# Altium schematic sheet OTHER.SchDoc
size 420 x 297 mm; SheetNumber: 8; SheetTotal: 9
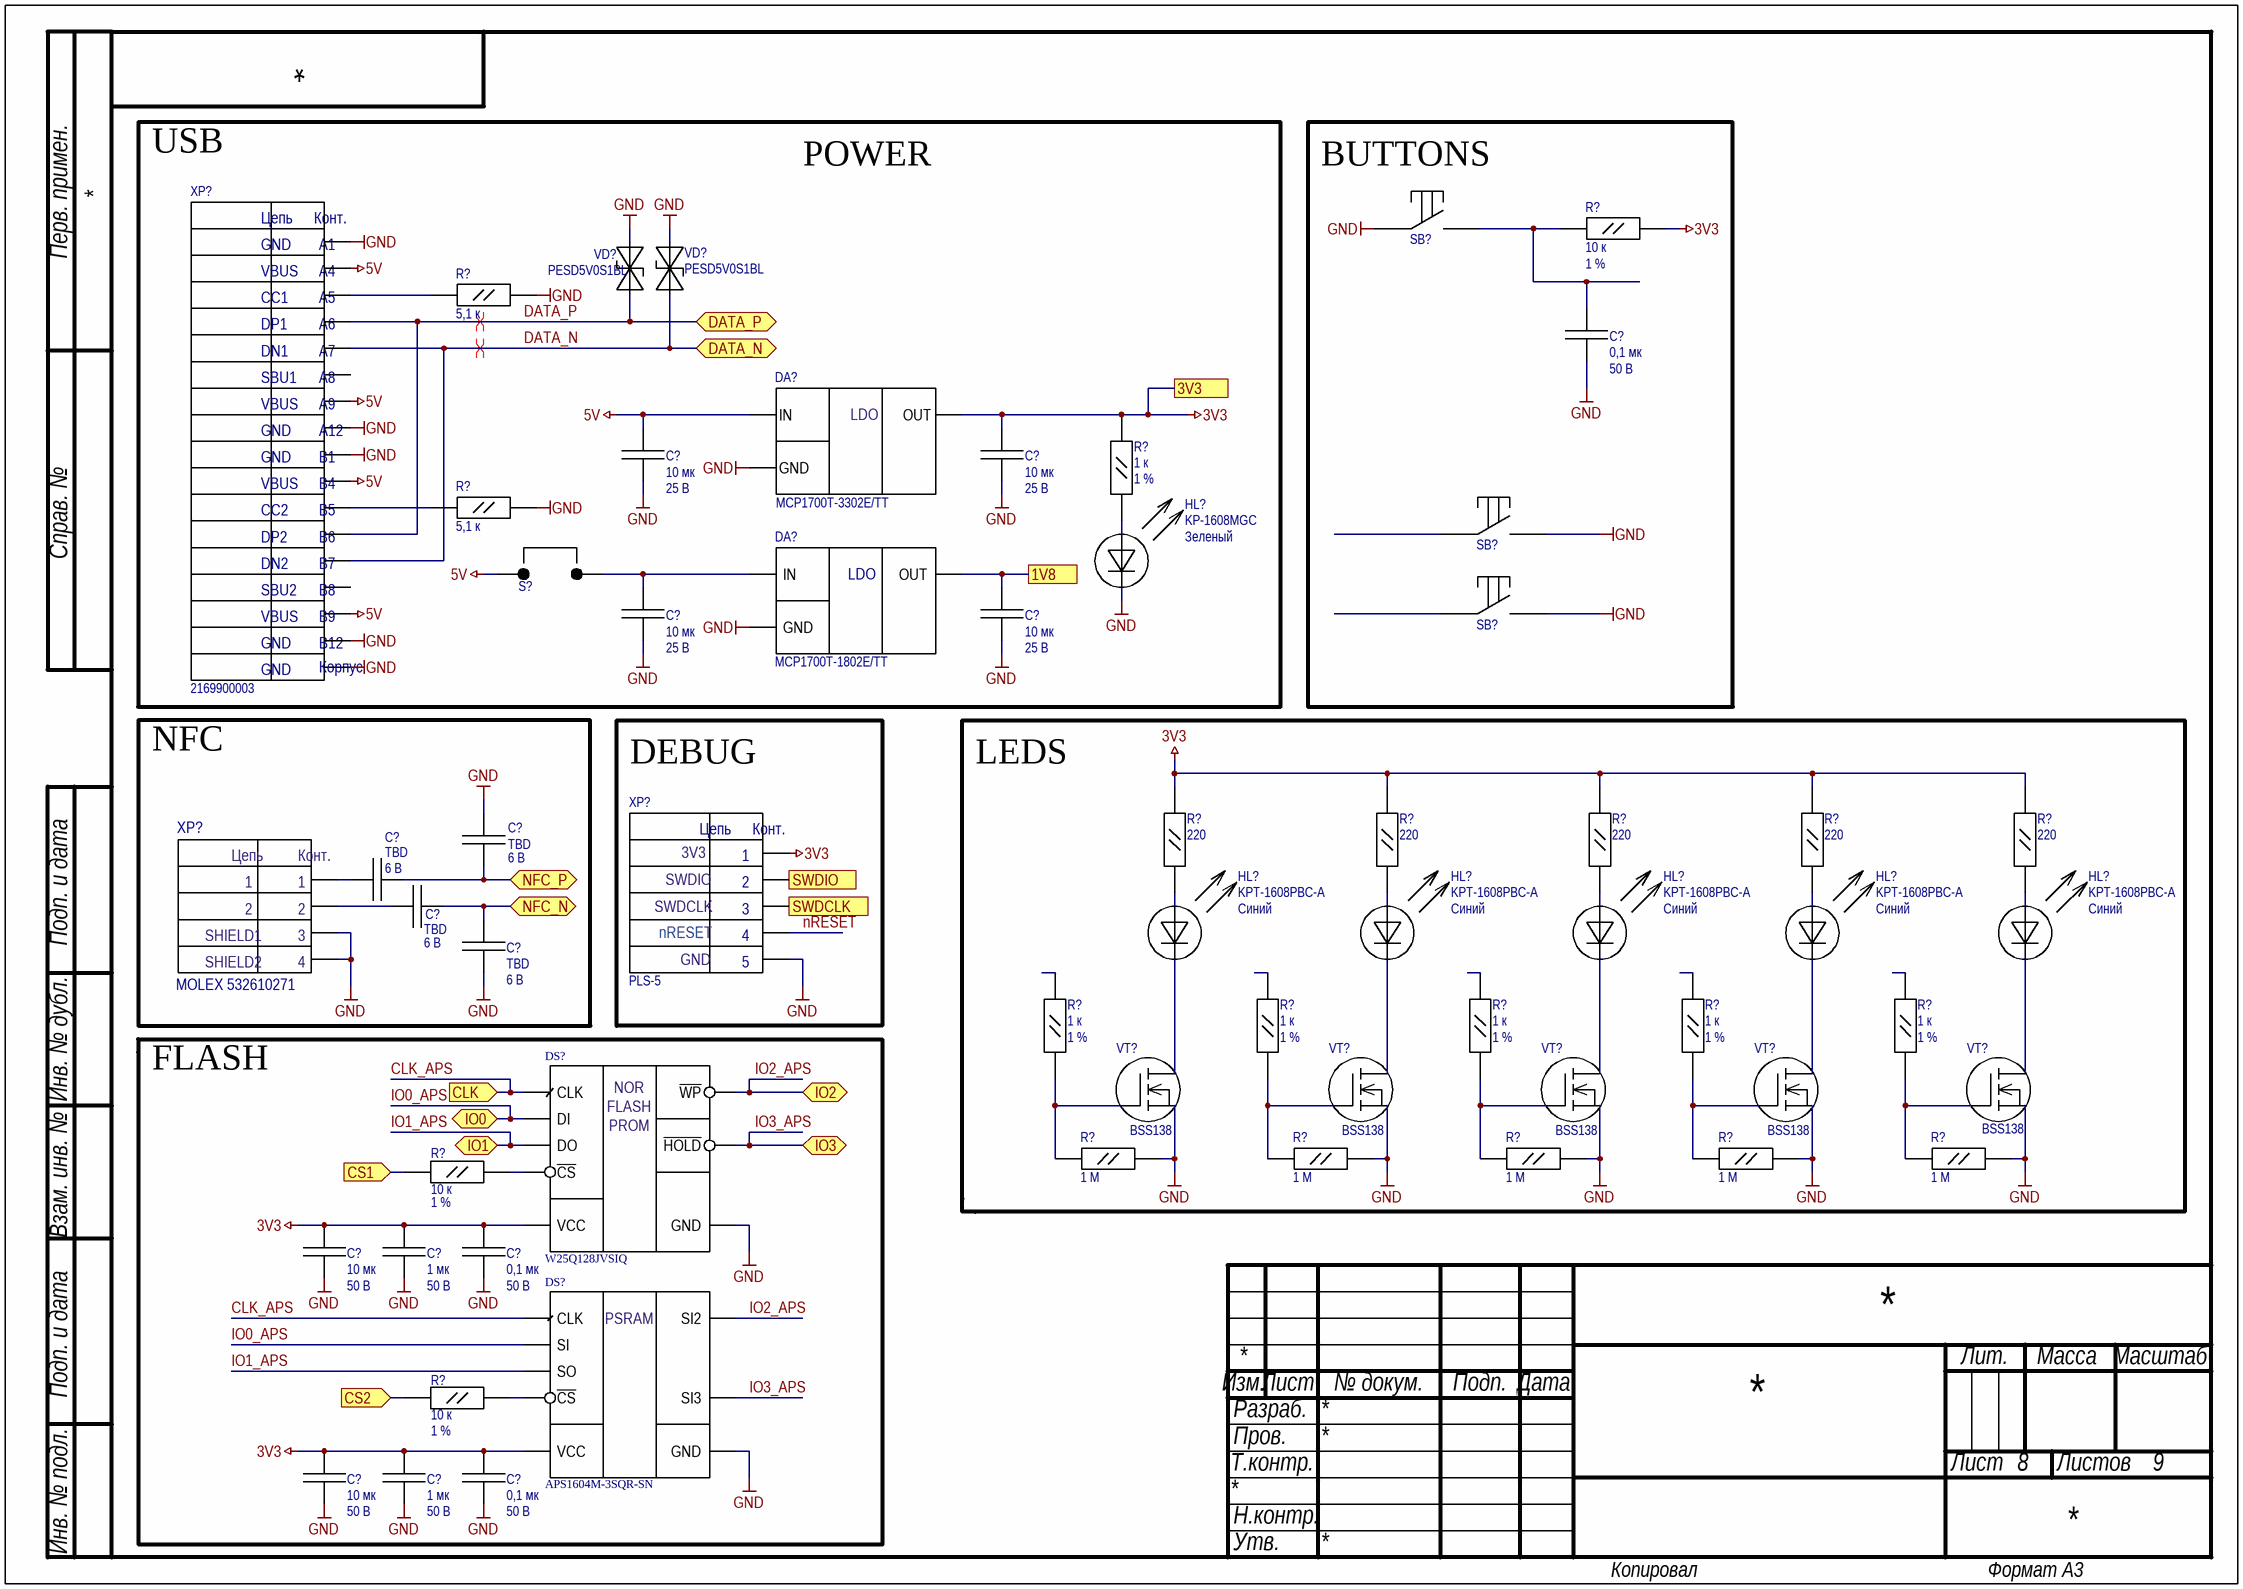
[diagram p0: OTHER.SchDoc]

## Parts
(Parts that share a designator on the sheet are numbered #1, #2 ... from top to bottom, then left to right.)
C?#1  value 0,1 мк  Rated voltage: 50 В  [C_0603_Manual_mount]  (hidden comment: GRM188R71H104KA93)
C?#2  value 10 мк  Rated voltage: 25 В  [C_0603_Manual_mount]  (hidden comment: GRM188R61E106MA73)
C?#3  value 10 мк  Rated voltage: 25 В  [C_0603_Manual_mount]  (hidden comment: GRM188R61E106MA73)
C?#4  value 10 мк  Rated voltage: 25 В  [C_0603_Manual_mount]  (hidden comment: GRM188R61E106MA73)
C?#5  value 10 мк  Rated voltage: 25 В  [C_0603_Manual_mount]  (hidden comment: GRM188R61E106MA73)
C?#6  value TBD  Rated voltage: 6 В  [C_0603_Manual_mount]  (hidden comment: /Укажите код маркировки/)
C?#7  value TBD  Rated voltage: 6 В  [C_0603_Manual_mount]  (hidden comment: /Укажите код маркировки/)
C?#8  value TBD  Rated voltage: 6 В  [C_0603_Manual_mount]  (hidden comment: /Укажите код маркировки/)
C?#9  value TBD  Rated voltage: 6 В  [C_0603_Manual_mount]  (hidden comment: /Укажите код маркировки/)
C?#10  value 10 мк  Rated voltage: 50 В  [C_1210_Manual_mount]  (hidden comment: GRM32ER61H106MA12)
C?#11  value 1 мк  Rated voltage: 50 В  [C_1206_Manual_mount]  (hidden comment: GRM31MR71H105KA88)
C?#12  value 0,1 мк  Rated voltage: 50 В  [C_0603_Manual_mount]  (hidden comment: GRM188R71H104KA93)
C?#13  value 10 мк  Rated voltage: 50 В  [C_1210_Manual_mount]  (hidden comment: GRM32ER61H106MA12)
C?#14  value 1 мк  Rated voltage: 50 В  [C_1206_Manual_mount]  (hidden comment: GRM31MR71H105KA88)
C?#15  value 0,1 мк  Rated voltage: 50 В  [C_0603_Manual_mount]  (hidden comment: GRM188R71H104KA93)
DA?#1  MCP1700T-3302E/TT  [SOT95P237X112-3N]
DA?#2  MCP1700T-1802E/TT  [SOT-23]
DS?#1  W25Q128JVSIQ  [SOIC127P790X216-8N]
DS?#2  APS1604M-3SQR-SN  [APS1604M (SOP-8)]
HL?#1  KP-1608MGC  Color: Зеленый  [LED_0603_Green_Auto_mount]
HL?#2  KPT-1608PBC-A  Color: Синий  [LED_0603_Blue_Auto_mount]
HL?#3  KPT-1608PBC-A  Color: Синий  [LED_0603_Blue_Auto_mount]
HL?#4  KPT-1608PBC-A  Color: Синий  [LED_0603_Blue_Auto_mount]
HL?#5  KPT-1608PBC-A  Color: Синий  [LED_0603_Blue_Auto_mount]
HL?#6  KPT-1608PBC-A  Color: Синий  [LED_0603_Blue_Auto_mount]
R?#1  value 10 к  Tolerance: 1 %  [R_0603_Manual_mount]  (hidden comment: RC0603FR-0710KL)
R?#2  value 5,1 к  [R_0603_Manual_mount]  (hidden comment: RC0603JR-075K1L)
R?#3  value 1 к  Tolerance: 1 %  [R_0603_Manual_mount]  (hidden comment: RC0603FR-071KL)
R?#4  value 5,1 к  [R_0603_Manual_mount]  (hidden comment: RC0603JR-075K1L)
R?#5  value 220  [R_0603_Manual_mount]  (hidden comment: RC0603JR-07220RL)
R?#6  value 220  [R_0603_Manual_mount]  (hidden comment: RC0603JR-07220RL)
R?#7  value 220  [R_0603_Manual_mount]  (hidden comment: RC0603JR-07220RL)
R?#8  value 220  [R_0603_Manual_mount]  (hidden comment: RC0603JR-07220RL)
R?#9  value 220  [R_0603_Manual_mount]  (hidden comment: RC0603JR-07220RL)
R?#10  value 1 к  Tolerance: 1 %  [R_0603_Manual_mount]  (hidden comment: RC0603FR-071KL)
R?#11  value 1 к  Tolerance: 1 %  [R_0603_Manual_mount]  (hidden comment: RC0603FR-071KL)
R?#12  value 1 к  Tolerance: 1 %  [R_0603_Manual_mount]  (hidden comment: RC0603FR-071KL)
R?#13  value 1 к  Tolerance: 1 %  [R_0603_Manual_mount]  (hidden comment: RC0603FR-071KL)
R?#14  value 1 к  Tolerance: 1 %  [R_0603_Manual_mount]  (hidden comment: RC0603FR-071KL)
R?#15  value 1 М  [R_0603_Manual_mount]  (hidden comment: RC0603JR-071ML)
R?#16  value 1 М  [R_0603_Manual_mount]  (hidden comment: RC0603JR-071ML)
R?#17  value 1 М  [R_0603_Manual_mount]  (hidden comment: RC0603JR-071ML)
R?#18  value 1 М  [R_0603_Manual_mount]  (hidden comment: RC0603JR-071ML)
R?#19  value 1 М  [R_0603_Manual_mount]  (hidden comment: RC0603JR-071ML)
R?#20  value 10 к  Tolerance: 1 %  [R_0603_Manual_mount]  (hidden comment: RC0603FR-0710KL)
R?#21  value 10 к  Tolerance: 1 %  [R_0603_Manual_mount]  (hidden comment: RC0603FR-0710KL)
S?  0  [Wedge Jumper 0603]  (value not drawn)  (no BOM)
SB?#1  Tact_switch  [Tact_switch_6x6x4.3]  (value not drawn)
SB?#2  Tact_switch  [Tact_switch_6x6x4.3]  (value not drawn)
SB?#3  Tact_switch  [Tact_switch_6x6x4.3]  (value not drawn)
VD?#1  PESD5V0S1BL  [SOD-882]
VD?#2  PESD5V0S1BL  [SOD-882]
VT?#1  BSS138  [SOT-23]
VT?#2  BSS138  [SOT-23]
VT?#3  BSS138  [SOT-23]
VT?#4  BSS138  [SOT-23]
VT?#5  BSS138  [SOT-23]
XP?#1  2169900003  [2169900003]
XP?#2  PLS-5  [PLS-5]
XP?#3  MOLEX 532610271  [MOLEX_532610271]

## Blocks framed on the sheet
BUTTONS: C?#1 R?#1 SB?#1-SB?#3
NFC: C?#6-C?#9 XP?#3
DEBUG: XP?#2
LEDS: HL?#2-HL?#6 R?#5-R?#19 VT?#1-VT?#5
FLASH: C?#10-C?#15 DS?#1 DS?#2 R?#20 R?#21

## Ports
1V8, 3V3, CLK (in), CS1 (in), CS2 (in), DATA_N (bidir), DATA_P (bidir), IO0 (bidir), IO1 (bidir), IO2 (bidir), IO3 (bidir), NFC_N (bidir), NFC_P (bidir), SWDCLK (out), SWDIO (out)

## Nets
3V3: C?#3.1 C?#10.1 C?#11.1 C?#12.1 C?#13.1 C?#14.1 C?#15.1 DA?#1.2(OUT) DS?#1.8(VCC) DS?#2.8(VCC) R?#1.2 R?#3.1 R?#5.2 R?#6.2 R?#7.2 R?#8.2 R?#9.2 XP?#2.1 ; port 3V3
5V: C?#2.1 DA?#1.3(IN) S?.1 XP?#1.A4 XP?#1.A9 XP?#1.B4 XP?#1.B9
GND: C?#1.2 C?#2.2 C?#3.2 C?#4.2 C?#5.2 C?#6.2 C?#9.1 C?#10.2 C?#11.2 C?#12.2 C?#13.2 C?#14.2 C?#15.2 DA?#1.1(GND) DA?#2.1(GND) DS?#1.4(GND) DS?#2.4(GND) HL?#1.C R?#2.2 R?#4.2 R?#15.2 R?#16.2 R?#17.2 R?#18.2 R?#19.2 SB?#1.1 SB?#2.2 SB?#3.2 VD?#1.1 VD?#2.1 VT?#1.2(S) VT?#2.2(S) VT?#3.2(S) VT?#4.2(S) VT?#5.2(S) XP?#1.0 XP?#1.A1 XP?#1.A12 XP?#1.B1 XP?#1.B12 XP?#2.5 XP?#3.S1(SHIELD1) XP?#3.S2(SHIELD2)
1V8: C?#5.1 DA?#2.2(OUT) ; port 1V8
CLK_APS: DS?#1.6(CLK) DS?#2.6(CLK) ; port CLK
CS1: R?#20.1 ; port CS1
CS2: R?#21.1 ; port CS2
DATA_N: VD?#2.2 XP?#1.A7 XP?#1.B7 ; port DATA_N
DATA_P: VD?#1.2 XP?#1.A6 XP?#1.B6 ; port DATA_P
IO0_APS: DS?#1.5(DI) DS?#2.5(SI) ; port IO0
IO1_APS: DS?#1.2(DO) DS?#2.2(SO) ; port IO1
IO2_APS: DS?#1.3(~{WP}) DS?#2.3(SI2) ; port IO2
IO3_APS: DS?#1.7(~{HOLD}) DS?#2.7(SI3) ; port IO3
NFC_N: C?#8.2 C?#9.2 ; port NFC_N
NFC_P: C?#6.1 C?#7.2 ; port NFC_P
nRESET: XP?#2.4
SWDCLK: XP?#2.3 ; port SWDCLK
SWDIO: XP?#2.2 ; port SWDIO
NetC?#1_1: C?#1.1 R?#1.1 SB?#1.2
NetC?#4_1: C?#4.1 DA?#2.3(IN) S?.2
NetC?#7_1: C?#7.1 XP?#3.1
NetC?#8_1: C?#8.1 XP?#3.2
NetDS?#1_1: DS?#1.1(~{CS}) R?#20.2
NetDS?#2_1: DS?#2.1(~{CS}) R?#21.2
NetHL?#1_A: HL?#1.A R?#3.2
NetHL?#2_A: HL?#2.A R?#5.1
NetHL?#2_C: HL?#2.C VT?#1.3(D)
NetHL?#3_A: HL?#3.A R?#6.1
NetHL?#3_C: HL?#3.C VT?#2.3(D)
NetHL?#4_A: HL?#4.A R?#7.1
NetHL?#4_C: HL?#4.C VT?#3.3(D)
NetHL?#5_A: HL?#5.A R?#8.1
NetHL?#5_C: HL?#5.C VT?#4.3(D)
NetHL?#6_A: HL?#6.A R?#9.1
NetHL?#6_C: HL?#6.C VT?#5.3(D)
NetR?#2_1: R?#2.1 XP?#1.A5
NetR?#4_1: R?#4.1 XP?#1.B5
NetR?#10_2: R?#10.2 R?#15.1 VT?#1.1(G)
NetR?#11_2: R?#11.2 R?#16.1 VT?#2.1(G)
NetR?#12_2: R?#12.2 R?#17.1 VT?#3.1(G)
NetR?#13_2: R?#13.2 R?#18.1 VT?#4.1(G)
NetR?#14_2: R?#14.2 R?#19.1 VT?#5.1(G)

Not connected (* = marked no-connect by the designer): R?#10 1; R?#11 1; R?#12 1; R?#13 1; R?#14 1; SB?#2 1; SB?#3 1; XP?#1 A8 B8

## Layout directives
differential pair; differential pair class USB: DATA_N, DATA_P

## Notes on the sheet
- USB
- POWER
- 3V3
- 1
- 2
- SWDCLK
- SWDIO
- (near XP?#3) SHIELD1
- (near XP?#3) SHIELD2
- (near XP?#2) nRESET
- GND
- Перв. примен.
- Справ. №
- Подп. и дата
- Инв. № дубл.
- Взам. инв. №
- Изм.
- Лист
- № докум.
- Подп.
- Дата
- Лит.
- Масса
- Масштаб
- Т.контр.
- Пров.
- Разраб.
- Листов
- Инв. № подл.
- Н.контр.
- Утв.
- Копировал
- Формат А3
- (in symbol 532610271) Цепь; Конт.; 3; 4
- (in symbol 2169900003) Цепь; Конт.; GND; VBUS; CC1; DP1; DN1; SBU1; CC2; DP2; DN2; SBU2; Корпус
- (in symbol MCP1700T-1802E/TT) LDO
- (in symbol MCP1700T-3302E/TT) LDO
- (in symbol PLS-5) Цепь; Конт.
- (in symbol W25Q128JVSIQ) NOR / FLASH / PROM /

## Library data of the parts
C?#1 C?#12 C?#15 = GRM188R71H104KA93: Chip Monolithic Ceramic Capacitor; Manufacturer: Murata Manufacturing; Tolerance: 10 %; Temperature coefficient: ±15 %; Type: Конденсатор керамический; TC: X7R; Size: 0603; Temperature range: -55 ... 125 °C; Part Number: GRM188R71H104KA93
C?#2-C?#5 = GRM188R61E106MA73: Chip Monolithic Ceramic Capacitor; Manufacturer: Murata Manufacturing; Tolerance: 20 %; Temperature coefficient: ±15 %; Type: Конденсатор керамический; TC: X5R; Size: 0603; Temperature range: -55 ... 85 °C; Part Number: GRM188R61E106MA73
C?#6-C?#9 = Capacitor 0603: SMD Capacitor 0603; Type: Конденсатор керамический; TC: C0G(NP0); Size: 0603; Part Number: Capacitor 0603; Component Type: Конденсатор керамический; Designator: Capacitor 0603; Pin Count: 2
C?#10 C?#13 = GRM32ER61H106MA12: Chip Monolithic Ceramic Capacitor; Manufacturer: Murata Manufacturing; Tolerance: 20 %; Temperature coefficient: ±15 %; Type: Конденсатор керамический; TC: X5R; Size: 1210; Temperature range: -55 ... 85 °C; Part Number: GRM32ER61H106MA12
C?#11 C?#14 = GRM31MR71H105KA88: Chip Monolithic Ceramic Capacitor; Manufacturer: Murata Manufacturing; Tolerance: 10 %; Temperature coefficient: ±15 %; Type: Конденсатор керамический; TC: X7R; Size: 1206; Temperature range: -55 ... 125 °C; Part Number: GRM31MR71H105KA88
DA?#1 = MCP1700T-3302E/TT: Low Quiescent Current LDO; Manufacturer: Microchip Technology; Output voltage: 3,3 В; Max. output current: 250 мА; Input voltage: 2,3...6 В; Type: Линейный регулятор напряжения
DA?#2 = MCP1700T-1802E/TT: Low Quiescent Current LDO; Manufacturer: Microchip Technology; Output voltage: 1,8 В; Max. output current: 200 мА; Input voltage: 2,3...6 В; Dropout voltage: 150 мВ; Type: Линейный регулятор напряжения с низким падением; Temperature range: -40 ... 125 °C
DS?#1 = W25Q128JVSIQ: FLASH - NOR Memory IC 128Mb (16M x 8) SPI - Quad I/O, QPI, DTR 133 MHz 8-SOIC; Manufacturer: Winbond; Type: Микросхема памяти; Type of memory: NOR FLASH PROM; Capacity: 128 Мбит; Interface: SPI/QSPI; Package type: SOIC-8
DS?#2 = APS1604M-3SQR-SN: Manufacturer: AP Memory; Type: Микросхема памяти; Type of memory: PSRAM; Capacity: 16 Мбит; Interface: SPI/QPI; Package type: TSOP-8
HL?#1 = KP-1608MGC: SMD LED; Manufacturer: Kingbright; Forward voltage: 2,1 В; Power dissitipation: 75 мВт; Type: Светодиод; Max. forward current: 30 мА; Max. reverse voltage: 5 В; Size: 0603; Temperature range: -40 ... 85 °C
HL?#2-HL?#6 = KPT-1608PBC-A: SMD LED; Manufacturer: Kingbright; Forward voltage: 3,2 В; Power dissitipation: 120 мВт; Type: Светодиод; Max. forward current: 30 мА; Max. reverse voltage: 5 В; Size: 0603; Temperature range: -40 ... 85 °C
R?#1 R?#20 R?#21 = RC0603FR-0710KL: General Purpose Chip Resistor; Manufacturer: YAGEO; Power dissipation: 0,1 Вт; Temperature coefficient: ±100 ppm/°C; Size: 0603; Temperature range: -55 ... 155 °C; Type: Резистор постоянный; Part Number: RC0603FR-0710KL
R?#2 R?#4 = RC0603JR-075K1L: General Purpose Chip Resistor; Manufacturer: YAGEO; Tolerance: 5 %; Power dissipation: 0,1 Вт; Temperature coefficient: ±100 ppm/°C; Size: 0603; Temperature range: -55 ... 155 °C; Type: Резистор постоянный; Part Number: RC0603JR-075K1L
R?#3 R?#10-R?#14 = RC0603FR-071KL: General Purpose Chip Resistor; Manufacturer: YAGEO; Power dissipation: 0,1 Вт; Temperature coefficient: ±100 ppm/°C; Size: 0603; Temperature range: -55 ... 155 °C; Type: Резистор постоянный; Part Number: RC0603FR-071KL
R?#5-R?#9 = RC0603JR-07220RL: General Purpose Chip Resistor; Manufacturer: YAGEO; Tolerance: 5 %; Power dissipation: 0,1 Вт; Temperature coefficient: ±100 ppm/°C; Size: 0603; Temperature range: -55 ... 155 °C; Type: Резистор постоянный; Part Number: RC0603JR-07220RL
R?#15-R?#19 = RC0603JR-071ML: General Purpose Chip Resistor; Manufacturer: YAGEO; Tolerance: 5 %; Power dissipation: 0,1 Вт; Temperature coefficient: ±100 ppm/°C; Size: 0603; Temperature range: -55 ... 155 °C; Type: Резистор постоянный; Part Number: RC0603JR-071ML
S? = Wedge jumper: Type: Перемычка
SB?#1-SB?#3 = Tact_switch: SMD pushbutton; Manufacturer: NONAME; Junction resistance: 100 мОм; Rated voltage: 12 В; Rated current: 50 мА; Life cycles: 100000; Type: Выключатель кнопочный с самовозвратом
VD?#1 VD?#2 = PESD5V0S1BL: Low capacitance bidirectional ESD protection diodes; Manufacturer: NXP; Type: Защитный диод; Input capacitance: 35 пФ; Clamping voltage: 14 В; Breakdown voltage: 5,5 ... 9,5 В; Peak pulse power: 130 Вт; Temperature range: -60 ... 150 °C
VT?#1-VT?#5 = BSS138: N-Channel Logic Level Enhancement Mode Field Effect Transistor; Manufacturer: Fairchild Semiconductor; Structure: Индуцированный канал n-типа; Type: Транзистор полевой с изолированным затвором; Max gate-to-source voltage: 20 В; Drain-to-source breakdown voltage: 50 В; Gate threshold voltage: 1,3 В; Max continuous drain current: 220 мА; Max pulsed drain current: 880 мА; Power dissitipation: 0,36 Вт; Input capacitance: 27 пФ; Output capacitance: 13 пФ; Turn-on time: 15 нс; Reverse transfer capacitance: 6 пФ; Turn-off time: 27 нс; Rds: 6 Ом; Forward transconductance: 500 мА/В; Temperature range: -55 ... 150 °C
XP?#1 = 2169900003: Female Type-C SMD USB Connectors
XP?#2 = PLS-5: PLS connector; Manufacturer: NONAME; Connector type: Вилка на плату; Number of contacts: 5; Type: Разъем штыревой
XP?#3 = 532610271: Connector Header Surface Mount, Right Angle 2 position 0.049 (1.25mm); Connector type: Вилка на плату; Number of contacts: 2; Manufacturer: MOLEX; Type: Разъем штыревой